# EAGLE design hubboard_v2 (EAGLE 9.0.1)
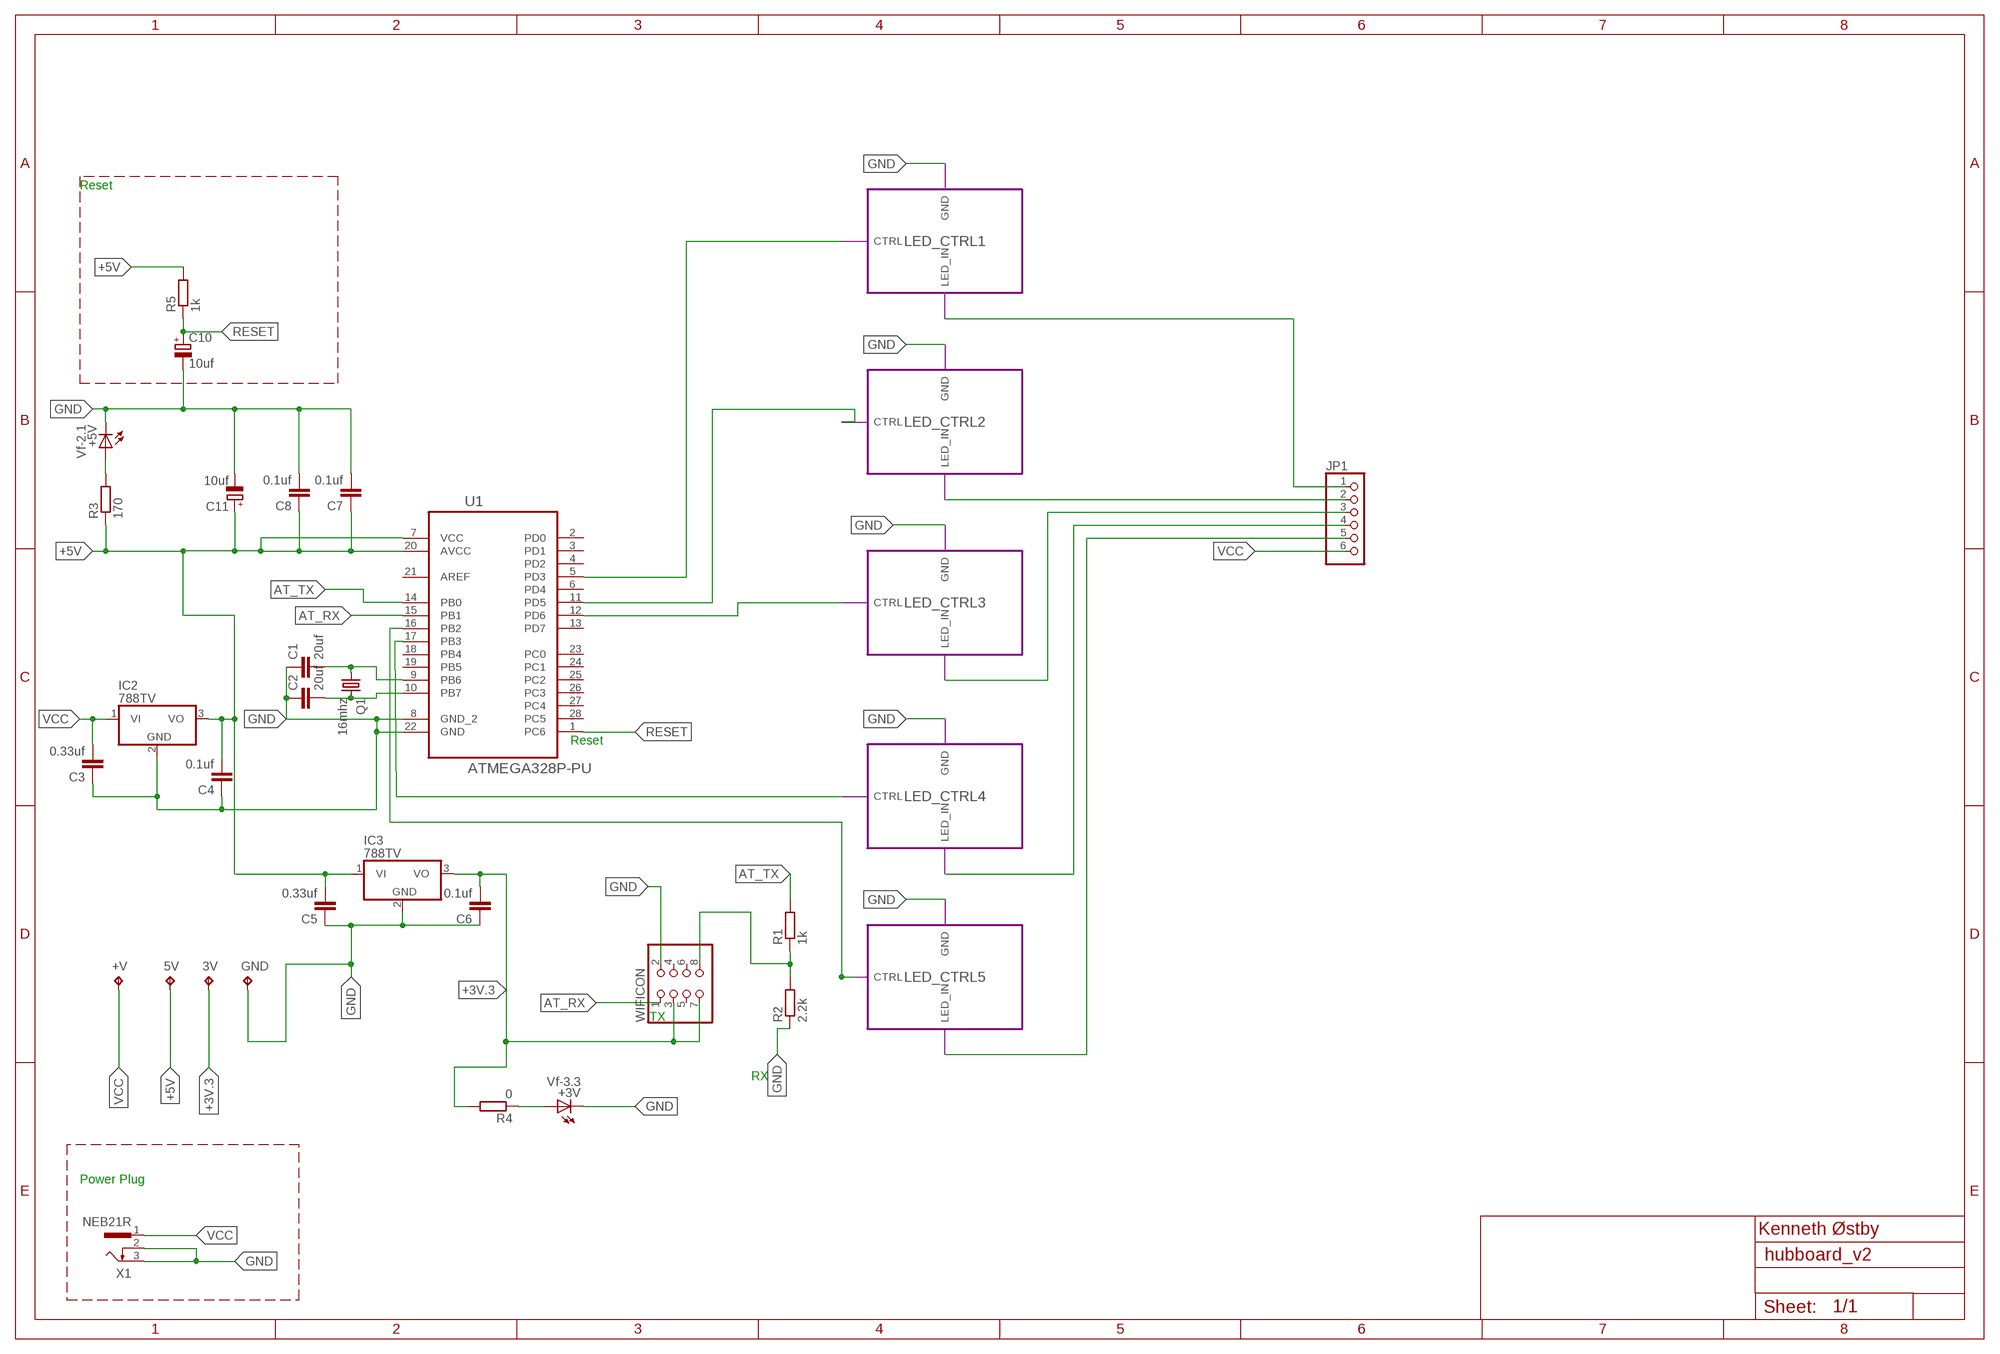
[diagram p0: schematic, sheet 1]

## Parts
3V  TPTP06SQ  [TP06SQ]
5V  TPTP06SQ  [TP06SQ]
+3V  Vf-3.3  LEDCHIP-LED0805  [CHIP-LED0805]
+5V  Vf-2.1  LEDCHIP-LED0805  [CHIP-LED0805]
+V  TPTP06SQ  [TP06SQ]
C1  20uf  C-EU025-040X050  [C025-040X050]
C2  20uf  C-EU025-040X050  [C025-040X050]
C3  0.33uf  C-EUC0805  [C0805]
C4  0.1uf  C-EUC0805  [C0805]
C5  0.33uf  C-EUC2012  [C2012]
C6  0.1uf  C-EUC0805  [C0805]
C7  0.1uf  C-EUC0805  [C0805]
C8  0.1uf  C-EUC0805  [C0805]
C10  10uf  CPOL-EUE2-4  [E2-4]
C11  10uf  CPOL-EUE2-4  [E2-4]
GND  TPTP06SQ  [TP06SQ]
IC2  788TV  [TO220V]
IC3  788TV  [TO220V]
JP1  PINHD-1X6  [1X06]
Q1  16mhz  CRYSTALHC49S  [HC49/S]
R1  1k  R-EU_0207/10  [0207/10]
R2  2.2k  R-EU_0207/10  [0207/10]
R3  170  R-EU_R0805  [R0805]
R4  0  R-EU_R0805  [R0805]
R5  1k  R-EU_R2012  [R2012]
U1  ATMEGA328P-PU  [DIP254P762X457-28]
WIFICON  PINHD-2X4  [2X04]
X1  NEB21R  [NEB21R]

## Module instances
LED_CTRL1 = LED_CTRL
LED_CTRL2 = LED_CTRL
LED_CTRL3 = LED_CTRL
LED_CTRL4 = LED_CTRL
LED_CTRL5 = LED_CTRL

## Nets
+3V.3: 3V.TP C6.2 IC3.3(VO) R4.2 WIFICON.3 WIFICON.7
+5V [+5v]: 5V.TP C4.2 C5.2 C7.1 C8.1 C11.+ IC2.3(VO) IC3.1(VI) R3.1 R5.2 U1.7(VCC) U1.20(AVCC)
AT_RX: U1.15(PB1) WIFICON.1
AT_TX: R1.2 U1.14(PB0)
GND: +3V.C +5V.C C1.1 C2.1 C3.1 C4.1 C5.1 C6.1 C7.2 C8.2 C10.- C11.- GND.TP IC2.2(GND) IC3.2(GND) R2.1 U1.8(GND_2) U1.22(GND) WIFICON.2 X1.2 X1.3 ; port LED_CTRL1.GND LED_CTRL2.GND LED_CTRL3.GND LED_CTRL4.GND LED_CTRL5.GND
N$1: JP1.1 ; port LED_CTRL1.LED_IN
N$2: JP1.2 ; port LED_CTRL2.LED_IN
N$3: JP1.3 ; port LED_CTRL3.LED_IN
N$4: JP1.4 ; port LED_CTRL4.LED_IN
N$5: JP1.5 ; port LED_CTRL5.LED_IN
N$6: U1.17(PB3) ; port LED_CTRL4.CTRL
N$7: U1.5(PD3) ; port LED_CTRL1.CTRL
N$8: U1.12(PD6) ; port LED_CTRL3.CTRL
N$9: C2.2 Q1.2 U1.10(PB7)
N$10: R1.1 R2.2 WIFICON.8
N$11: U1.16(PB2) ; port LED_CTRL5.CTRL
N$12: U1.11(PD5) ; port LED_CTRL2.CTRL
N$13: +5V.A R3.2
N$14: +3V.A R4.1
N$15: C1.2 Q1.1 U1.9(PB6)
RESET [+5v]: C10.+ R5.1 U1.1(PC6)
VCC [vcc]: +V.TP C3.2 IC2.1(VI) JP1.6 X1.1
Unconnected: U1.2(PD0) U1.3(PD1) U1.4(PD2) U1.6(PD4) U1.13(PD7) U1.18(PB4) U1.19(PB5) U1.21(AREF) U1.23(PC0) U1.24(PC1) U1.25(PC2) U1.26(PC3) U1.27(PC4) U1.28(PC5) WIFICON.4 WIFICON.5 WIFICON.6

## Notes on the sheet
- Reset
- Reset
- TX
- RX
- Power Plug
- Kenneth Østby

## Library data of the parts
3V 5V +V GND = testpad:TP: Test pad; OC_FARNELL: unknown
+3V +5V = led:LED: LED OSRAM: - CHIPLED LG R971, LG N971, LY N971, LG Q971, LY Q971, LO R971, LY R971 LH N974, LH R974 LS Q976, LO Q976, LY Q976 LO Q996 - Hyper CHIPLED LW Q18S LB Q993, LB Q99A, LB R99A - SideLED LS A670, LO A670, LY A670, LG A670, LP A670 LB A673, LV A673, LT A673, LW A673 LH A674 LY A675 LS A676, LA A676, LO A676, LY A676, LW A676 LS A679, LY A679, LG A679 - Hyper Micro SIDELED® LS Y876, LA Y876, LO Y876, LY Y876 LT Y87S - SmartLED LW L88C, LW L88S LB L89C, LB L89S, LG L890 LS L89K, LO L89K, LY L89K LS L896, LA L896, LO L896, LY L896 - TOPLED LS T670, LO T670, LY T670, LG T670, LP T670 LSG T670, LSP T670, LSY T670, LOP T670, LYG T670 LG T671, LOG T671, LSG T671 LB T673, LV T673, LT T673, LW T673 LH T674 LS T676, LA T676, LO T676, LY T676, LB T676, LH T676, LSB T676, LW T676 LB T67C, LV T67C, LT T67C, LS T67K, LO T67K, LY T67K, LW E67C LS E67B, LA E67B, LO E67B, LY E67B, LB E67C, LV E67C, LT E67C LW T67C LS T679, LY T679, LG T679 LS T770, LO T770, LY T770, LG T770, LP T770 LB T773, LV T773, LT T773, LW T773 LH T774 LS E675, LA E675, LY E675, LS T675 LS T776, LA T776, LO T776, LY T776, LB T776 LHGB T686 LT T68C, LB T68C - Hyper Mini TOPLED® LB M676 - Mini TOPLED Santana® LG M470 LS M47K, LO M47K, LY M47K Source: http://www.osram.convergy.de LUXEON: - LUMILED® LXK2-PW12-R00, LXK2-PW12-S00, LXK2-PW14-U00, LXK2-PW14-V00 LXK2-PM12-R00, LXK2-PM12-S00, LXK2-PM14-U00 LXK2-PE12-Q00, LXK2-PE12-R00, LXK2-PE12-S00, LXK2-PE14-T00, LXK2-PE14-U00 LXK2-PB12-K00, LXK2-PB12-L00, LXK2-PB12-M00, LXK2-PB14-N00, LXK2-PB14-P00, LXK2-PB14-Q00 LXK2-PR12-L00, LXK2-PR12-M00, LXK2-PR14-Q00, LXK2-PR14-R00 LXK2-PD12-Q00, LXK2-PD12-R00, LXK2-PD12-S00 LXK2-PH12-R00, LXK2-PH12-S00 LXK2-PL12-P00, LXK2-PL12-Q00, LXK2-PL12-R00 Source: www.luxeon.com KINGBRIGHT: KA-3528ASYC Source: www.kingbright.com; OC_FARNELL: unknown
C1-C8 = rcl:C-EU: CAPACITOR, European symbol; OC_FARNELL: unknown; SPICEPREFIX: C
C10 C11 = rcl:CPOL-EU: POLARIZED CAPACITOR, European symbol; SPICEPREFIX: C
IC2 IC3 = linear:78*: Positive VOLTAGE REGULATOR Source: http://cache.national.com/ds/LM/LM78L05.pdf http://www.fairchildsemi.com/ds/LM/LM7805.pdf; OC_FARNELL: unknown
JP1 = pinhead:PINHD-1X6: PIN HEADER; OC_FARNELL: unknown
Q1 = crystal:CRYSTAL: CRYSTAL; MF: MULTICOMP; MPN: HC49SM-3.6864-30-50-60-16-ATF; OC_FARNELL: 1667008; OC_NEWARK: unknown
R1 R5 = rcl:R-EU_: RESISTOR, European symbol; MF: MULTICOMP; MPN: MCF 0.25W 1K; OC_FARNELL: 9339051; SPICEPREFIX: R
R2 = rcl:R-EU_: RESISTOR, European symbol; MF: MULTICOMP; MPN: MF12 2K2; OC_FARNELL: 9342834; SPICEPREFIX: R
R3 R4 = rcl:R-EU_: RESISTOR, European symbol; OC_FARNELL: unknown; SPICEPREFIX: R
U1 = Atmel_By_element14_Batch_1-00:ATMEGA328P-PU: 8-bit Microcontroller with In-System Programmable Flash; MF: MICROCHIP; MPN: ATMEGA328P-PU; OC_FARNELL: 1715487; OC_NEWARK: 15R0268; PACKAGE: PDIP-28; SUPPLIER: Atmel
WIFICON = pinhead:PINHD-2X4: PIN HEADER; OC_FARNELL: unknown
X1 = con-lumberg:NEB21R: Netzgeräte-Einbaukupplung abgewinkelte Ausführung mit Öffner Source: http://www.lumberg.com/Produkte/PDFs/NEB21R.pdf; MF: LUMBERG; MPN: NEB 21 R; OC_FARNELL: 1217037; OC_NEWARK: 97K6458

## Module LED_CTRL
Ports: CTRL(io) GND(io) LED_IN(io)
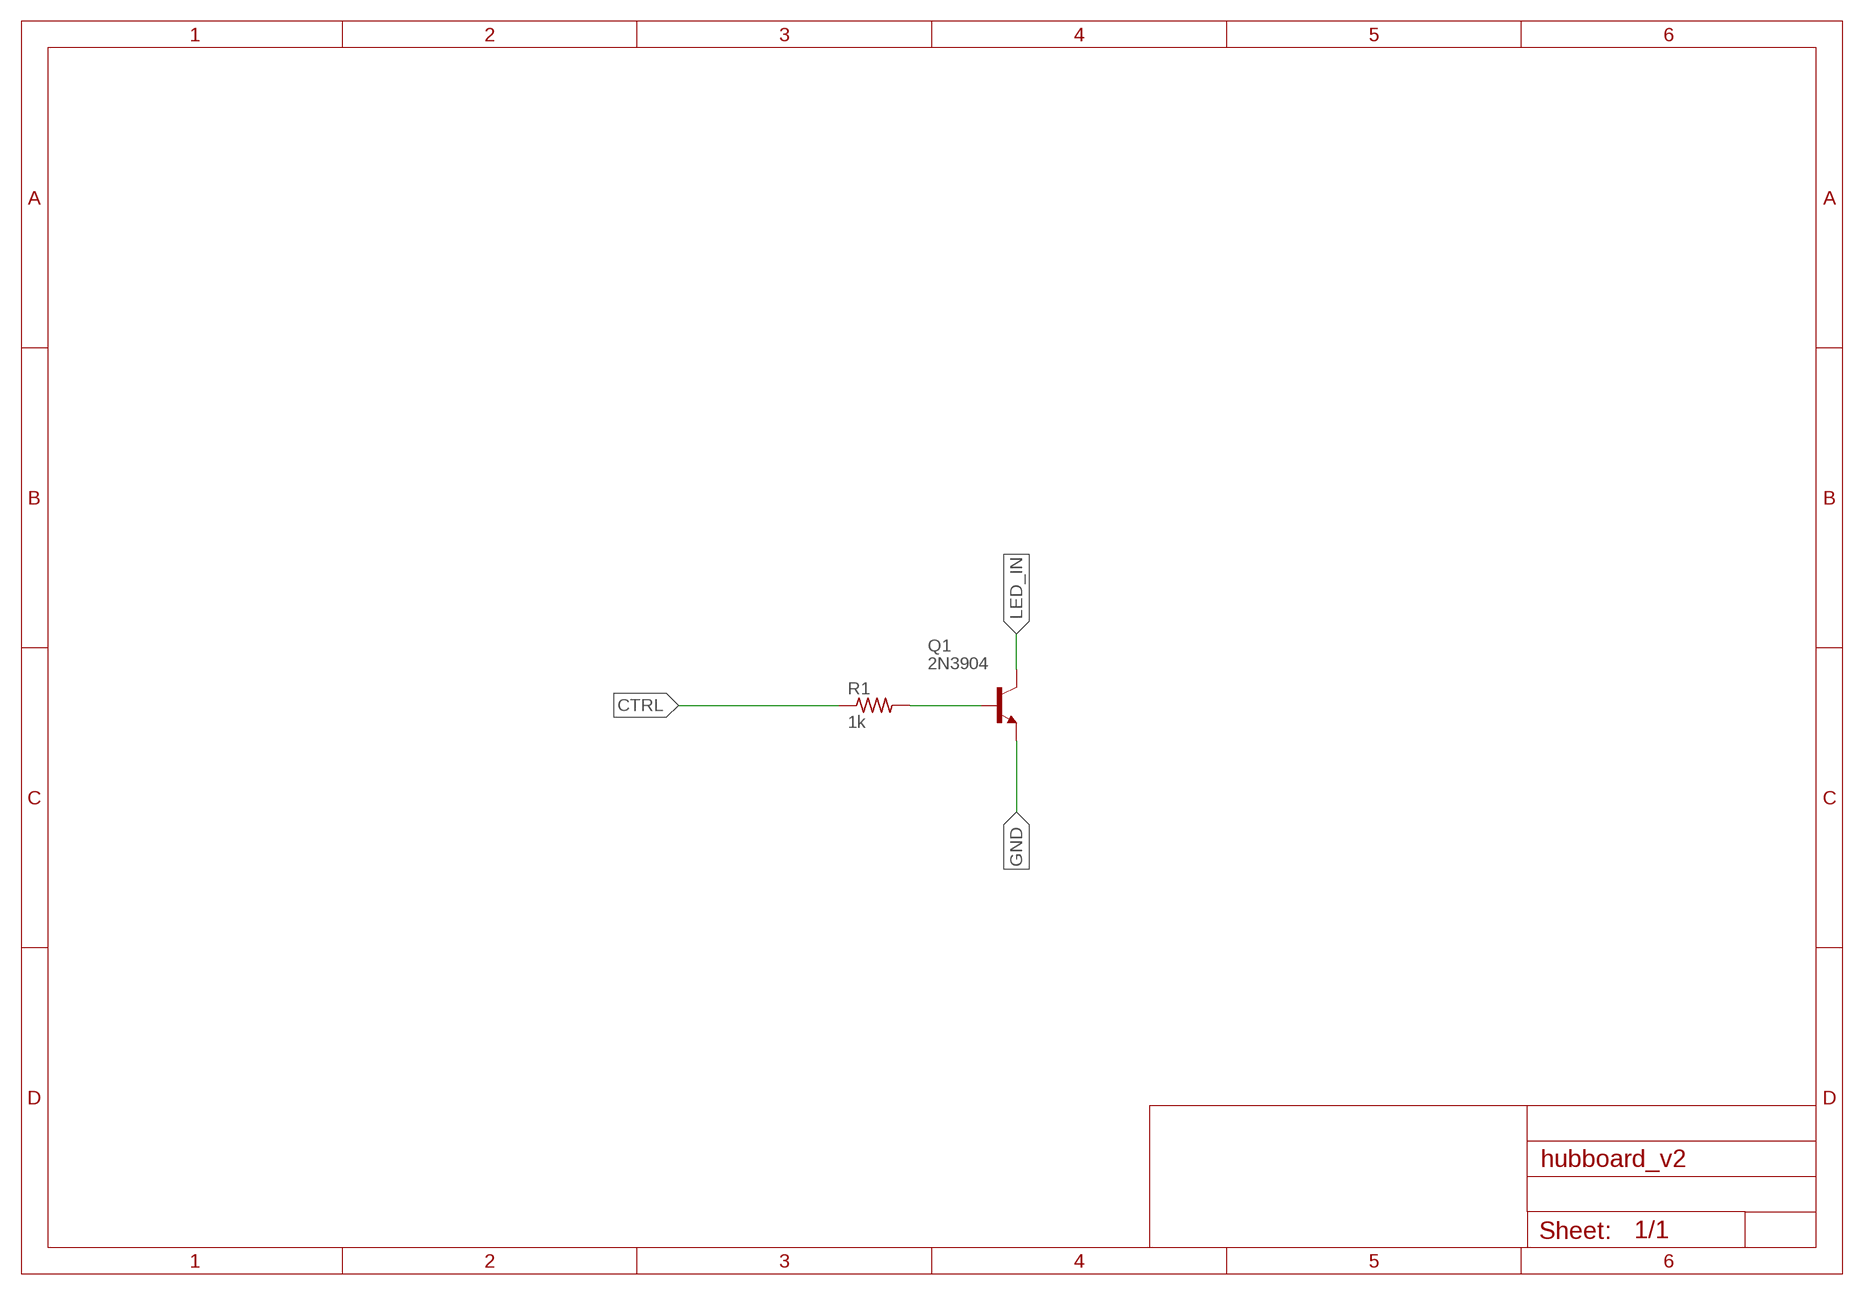
[diagram p1: schematic, module LED_CTRL, sheet 1]

### Parts
Q1  2N3904  [TO92]
R1  1k  R-US_0204/7  [0204/7]

### Nets
CTRL: R1.1
GND: Q1.3(E)
LED_IN: Q1.1(C)
N$1: Q1.2(B) R1.2

### Library data of the parts
Q1 = transistor-npn:2N3904: NPN Transistor; MF: MULTICOMP; MPN: 2N3904; OC_FARNELL: 1574370
R1 = resistor:R-US_: RESISTOR, American symbol; MF: MULTICOMP; MPN: MCF 0.25W 1K; OC_FARNELL: 9339051

## Net classes
1 +5v: width 0.508 mm, clearance 0.127 mm
2 vcc: width 0.508 mm, clearance 0.127 mm

## Board
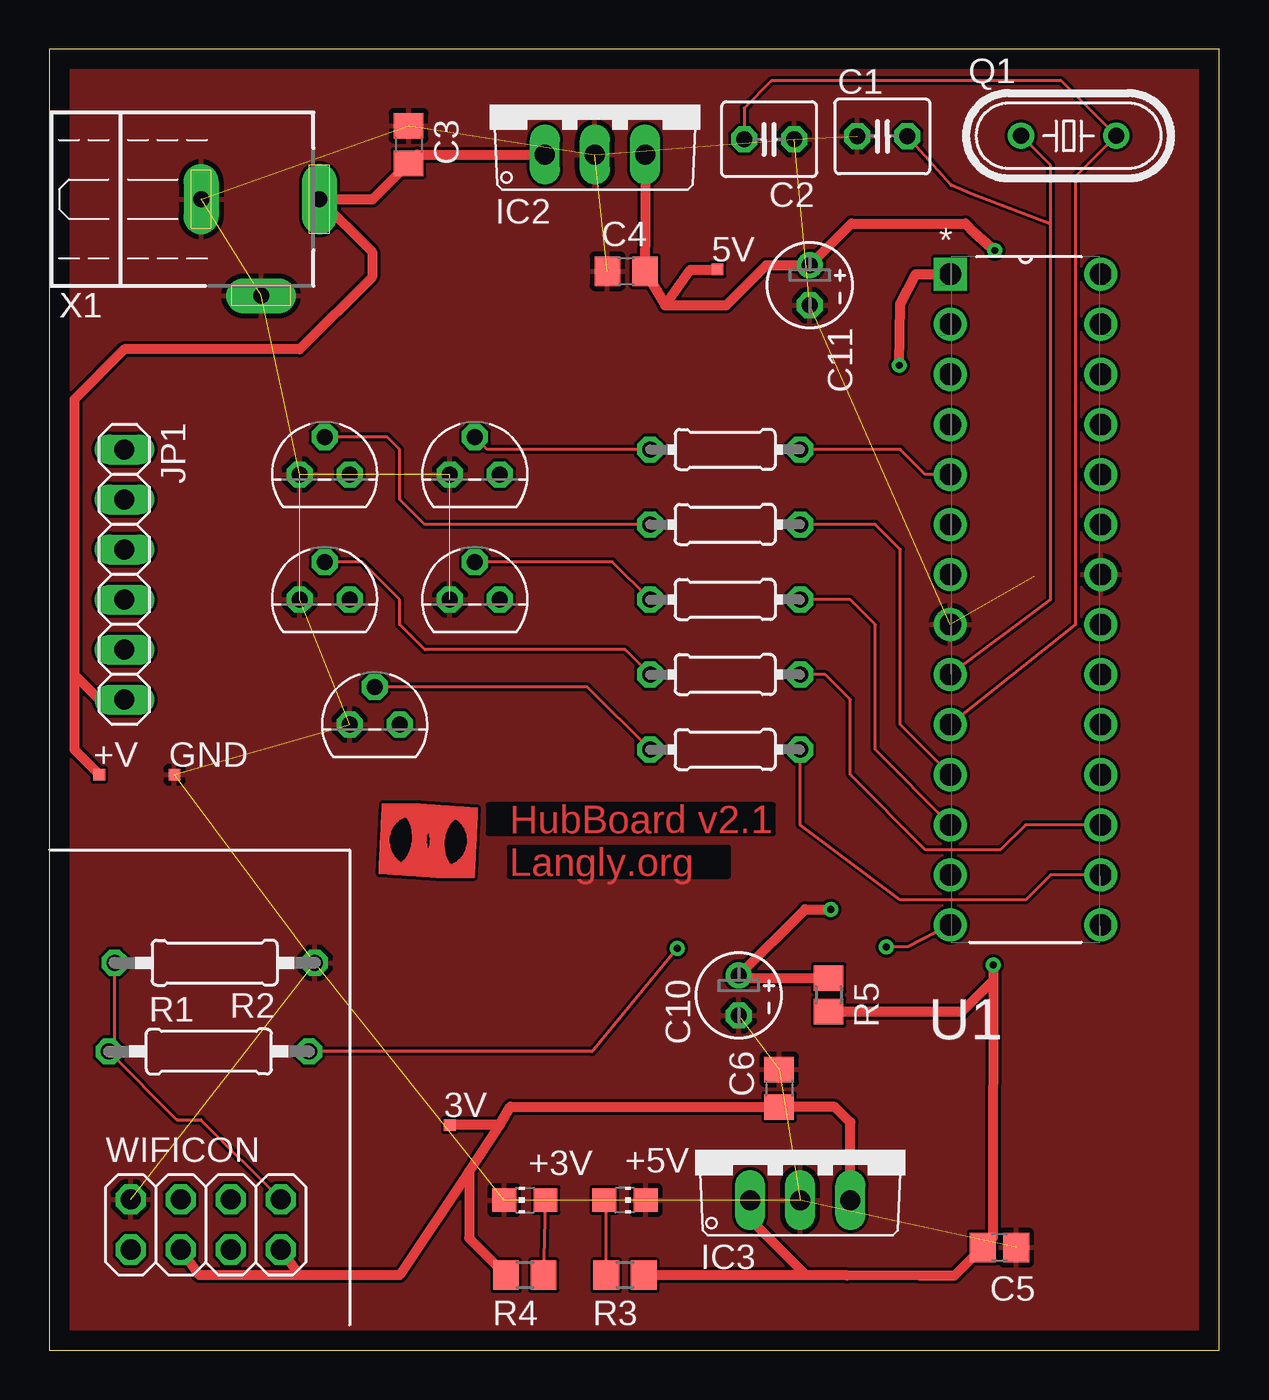
[diagram p2: board, top side]
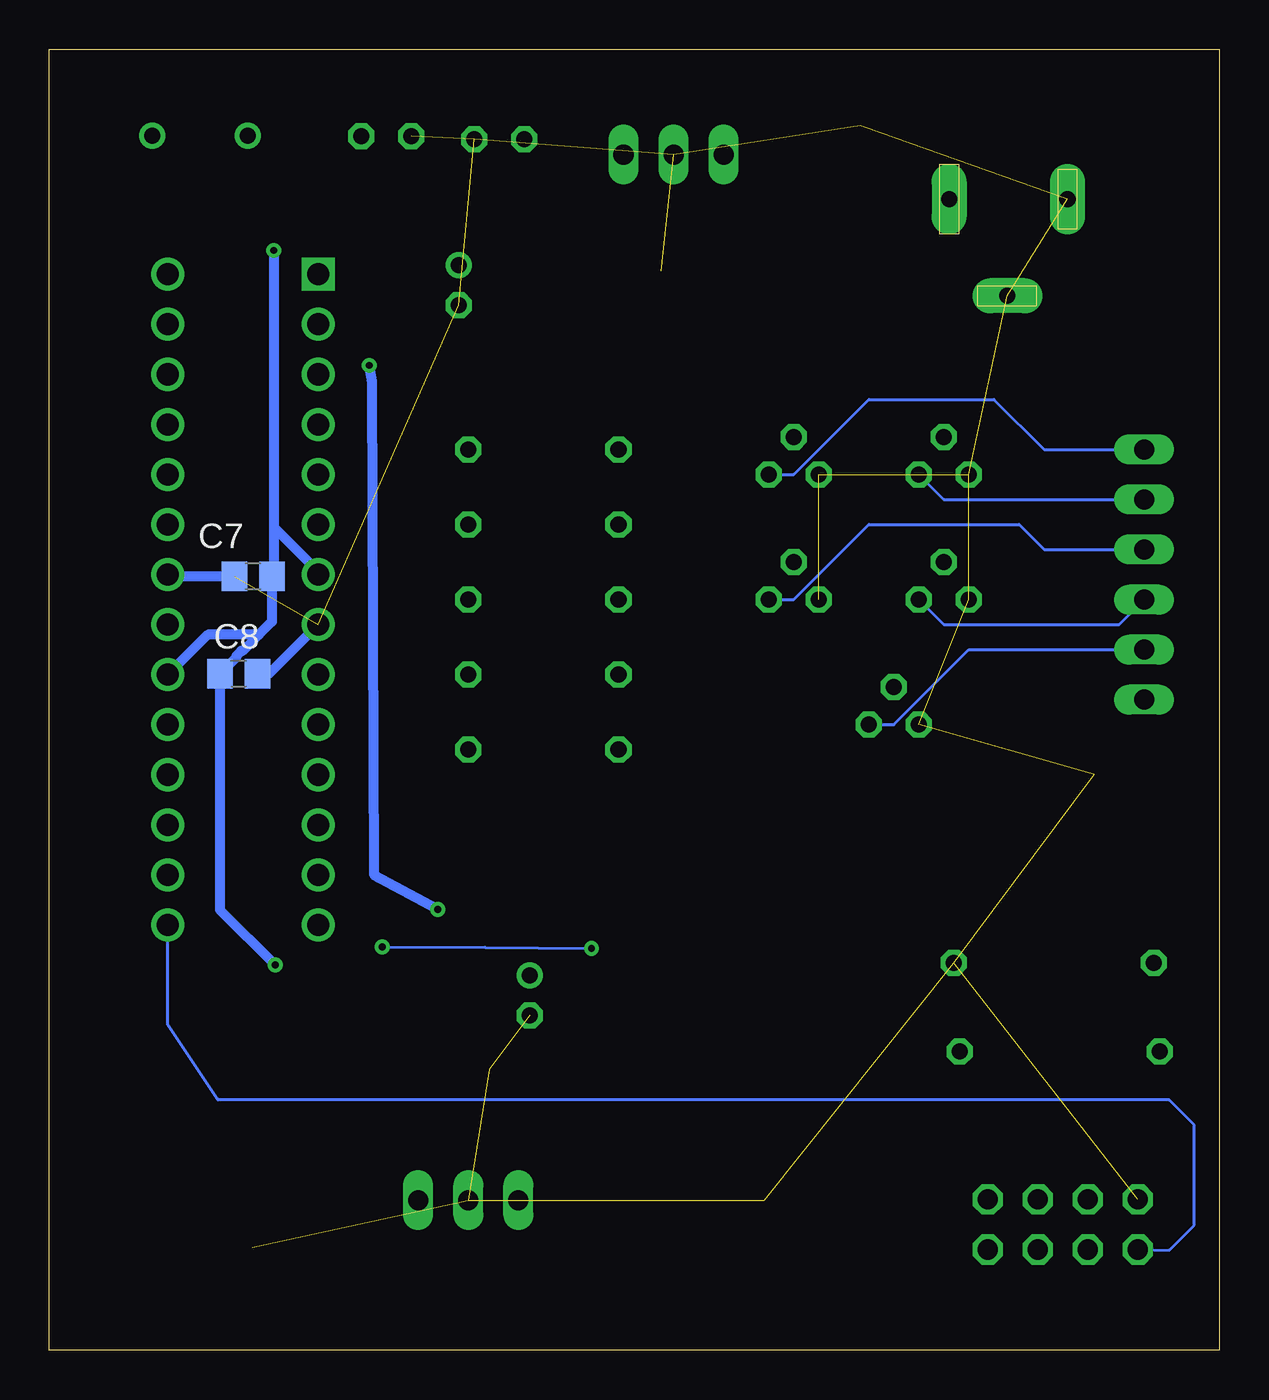
[diagram p3: board, bottom side, seen from below]

Size 59.36 x 66.03 mm. Coordinates in mm from the lower left corner, seen from the top.
Outline: 0,0 59.36,0 59.36,66.03 0,66.03 0,0
Copper layers (1*16): Top 0.035mm / dielectric 1.5mm / Bottom 0.035mm
Design rules "default": minimum track width 6mil, minimum drill 0.35mm, track to track 6mil, track to pad 6mil, pad to pad 6mil, via to via 6mil, smd to smd 6mil, copper to edge 40mil, drill to drill 6mil, minimum pad ring 10mil, minimum via ring 8mil, stop-mask expansion 4mil, vias tented up to drill 0mil, thermal gap 10mil

### Footprints (pad centres in the part's own frame; a part is rotated, then mirrored left to right if it is on the bottom)
TP06SQ = smd 0.6 x 0.6: TP 0,0
CHIP-LED0805 = smd 1.2 x 1.2: A 0,-1.05; C 0,1.05
C025-040X050 = drill 0.813 octagon: 1 -1.27,0; 2 1.27,0
C0805 = smd 1.3 x 1.5: 1 -0.95,0; 2 0.95,0
C2012 = smd 1.3 x 1.5: 1 -0.85,0; 2 0.85,0
E2-4 = drill 0.813 pad 1.27: + -1.016,0 | drill 0.813 pad 1.27 octagon: - 1.016,0
TO220V = drill 1.016 long: 1 -2.54,-2.54; 2 0,-2.54; 3 2.54,-2.54
1X06 = drill 1.016 long: 1 -6.35,0; 2 -3.81,0; 3 -1.27,0; 4 1.27,0; 5 3.81,0; 6 6.35,0
TO92 = drill 0.813 octagon: 1 1.27,0; 2 0,1.905; 3 -1.27,0
0204/7 = drill 0.813 octagon: 1 -3.81,0; 2 3.81,0
HC49/S = drill 0.813: 1 -2.413,0; 2 2.413,0
0207/10 = drill 0.813 octagon: 1 -5.08,0; 2 5.08,0
R0805 = smd 1.3 x 1.5: 1 -0.95,0; 2 0.95,0
R2012 = smd 1.3 x 1.5: 1 -0.85,0; 2 0.85,0
DIP254P762X457-28 = drill 1.118 square: 1 -7.62,33.02 | drill 1.118: 2 -7.62,30.48; 3 -7.62,27.94; 4 -7.62,25.4; 5 -7.62,22.86; 6 -7.62,20.32; 7 -7.62,17.78; 8 -7.62,15.24; 9 -7.62,12.7; 10 -7.62,10.16; 11 -7.62,7.62; 12 -7.62,5.08; 13 -7.62,2.54; 14 -7.62,0; 15 0,0; 16 0,2.54; 17 0,5.08; 18 0,7.62; 19 0,10.16; 20 0,12.7; 21 0,15.24; 22 0,17.78; 23 0,20.32; 24 0,22.86; 25 0,25.4; 26 0,27.94; 27 0,30.48; 28 0,33.02
2X04 = drill 1.016 octagon: 1 -3.81,-1.27; 2 -3.81,1.27; 3 -1.27,-1.27; 4 -1.27,1.27; 5 1.27,-1.27; 6 1.27,1.27; 7 3.81,-1.27; 8 3.81,1.27
NEB21R = drill 0.813 pad 1.778 long: 1 0,7.35; 2 4.9,4.4; 3 0,1.35

### Placement (x,y rotation side)
3V  20.32,11.43 0 top
5V  33.9,54.85 0 top
+3V  24.13,7.62 90 top
+5V  29.21,7.62 270 top
+V  2.54,29.21 0 top
C1  42.27,61.61 0 top
C2  36.53,61.46 180 top
C3  18.23,61.19 270 top
C4  29.27,54.76 0 top
C5  48.21,5.21 180 top
C6  37.03,13.3 270 top
C7  49.01,39.28 180 bottom
C8  49.75,34.34 0 bottom
C10  34.98,18 270 top
C11  38.59,54.05 270 top
GND  6.35,29.21 0 top
IC2  27.69,63.23 0 top
IC3  38.1,10.16 0 top
JP1  3.81,39.37 270 top
LED_CTRL1:Q1  2N3904  [TO92]  21.59,44.45 0 top
LED_CTRL1:R1  1k  [0204/7]  34.29,45.72 180 top
LED_CTRL2:Q1  2N3904  [TO92]  13.97,44.45 0 top
LED_CTRL2:R1  1k  [0204/7]  34.29,41.91 180 top
LED_CTRL3:Q1  2N3904  [TO92]  21.59,38.1 0 top
LED_CTRL3:R1  1k  [0204/7]  34.29,38.1 180 top
LED_CTRL4:Q1  2N3904  [TO92]  13.97,38.1 0 top
LED_CTRL4:R1  1k  [0204/7]  34.29,34.29 180 top
LED_CTRL5:Q1  2N3904  [TO92]  16.51,31.75 0 top
LED_CTRL5:R1  1k  [0204/7]  34.29,30.48 180 top
Q1  51.71,61.64 0 top
R1  8.1,15.16 0 top
R2  8.39,19.67 180 top
R3  29.21,3.81 180 top
R4  24.13,3.81 180 top
R5  39.54,18.03 270 top
U1  53.34,21.59 0 top
WIFICON  7.93,6.38 0 top
X1  6.35,58.42 270 top

### Tracks (layer width: path | path; a pad name or v marks a point on that pad's centre or on a via)
+3V.3
  Top 0.508: 22.86,11.43 21.3,9.09 | 21.3,9.09 17.78,3.81 12.7,3.81 | 12.7,3.81 7.62,3.81 WIFICON.3 | 12.7,3.81 WIFICON.7 | 21.3,9.09 21.3,5.69 R4.2 | 22.86,11.43 3V.TP | 22.86,11.43 23.4,12.36 C6.2 | IC3.3 40.64,11.57 39.86,12.35 C6.2 | C6.2
+5V  (via drill 0.35)
  Top 0.508: v47.97,55.82 46.94,56.73 46.49,57.18 40.7,57.18 C11.+ 36.37,55.07 34.34,53.03 31.24,53.03 | v47.89,19.55 47.89,18.77 | 47.89,18.77 47.88,17.72 47.87,9.2 47.87,5.73 C5.2 45.93,3.78 44.16,3.78 40.48,3.8 39.37,3.81 38.41,3.81 | 38.41,3.81 R3.1 | 38.41,3.81 35.56,6.66 IC3.1 | IC2.3 30.23,57.16 C4.2 31.24,53.03 | 31.24,53.03 32.52,54.84 5V.TP | 47.89,18.77 46.31,17.18 R5.2
  Bottom 0.508: v47.89,19.55 50.7,22.36 C8.1 49.86,35.18 49.86,35.26 49.62,35.5 49.55,35.5 48.73,36.31 | v47.97,55.82 47.97,41.77 | 47.97,41.77 47.97,39.38 C7.1 48.06,36.98 48.73,36.31 | 48.73,36.31 51.32,36.31 U1.20 | 47.97,41.77 45.72,39.52 U1.7
AT_RX
  Bottom 0.152: WIFICON.1 2.54,5.08 1.27,6.35 1.27,11.43 2.54,12.7 50.8,12.7 53.34,16.51 U1.15
AT_TX  (via drill 0.35)
  Top 0.152: v31.85,20.39 27.61,15.23 27.53,15.16 R1.2 | U1.14 43.57,20.47 v42.47,20.46
  Bottom 0.152: v42.47,20.46 37.25,20.45 v31.85,20.39
GND  (23 unrouted)
  Bottom 0.508: C8.2 48.21,34.34 U1.8 | C7.2 53.25,39.28 U1.22
  pour Top: 0,66.04 59.69,66.04 59.69,-1.27 0,-1.27
LED_CTRL1:N$1
  Top 0.152: LED_CTRL1:Q1.2 22.23,45.72 LED_CTRL1:R1.2
LED_CTRL2:N$1
  Top 0.152: LED_CTRL2:R1.2 19.05,41.91 17.78,43.18 17.78,45.72 17.14,46.35 LED_CTRL2:Q1.2
LED_CTRL3:N$1
  Top 0.152: LED_CTRL3:R1.2 28.57,40.01 LED_CTRL3:Q1.2
LED_CTRL4:N$1
  Top 0.152: LED_CTRL4:R1.2 29.21,35.56 19.05,35.56 17.78,36.83 17.78,38.1 15.88,40.01 LED_CTRL4:Q1.2
LED_CTRL5:N$1
  Top 0.152: LED_CTRL5:Q1.2 27.3,33.66 LED_CTRL5:R1.2
N$1
  Bottom 0.152: LED_CTRL1:Q1.1 21.59,44.45 17.78,48.26 11.43,48.26 8.89,45.72 JP1.1
N$2
  Bottom 0.152: LED_CTRL2:Q1.1 13.97,43.18 JP1.2
N$3
  Bottom 0.152: LED_CTRL3:Q1.1 21.59,38.1 17.78,41.91 10.16,41.91 8.89,40.64 JP1.3
N$4
  Bottom 0.152: LED_CTRL4:Q1.1 13.97,36.83 5.08,36.83 JP1.4
N$5
  Bottom 0.152: LED_CTRL5:Q1.1 16.51,31.75 12.7,35.56 JP1.5
N$6
  Top 0.152: U1.17 49.53,26.67 48.26,25.4 44.45,25.4 40.64,29.21 40.64,33.02 39.37,34.29 LED_CTRL4:R1.1
N$7
  Top 0.152: U1.5 44.45,44.45 43.18,45.72 LED_CTRL1:R1.1
N$8
  Top 0.152: U1.12 41.91,30.48 41.91,36.83 40.64,38.1 LED_CTRL3:R1.1
N$9
  Top 0.152: U1.10 52.07,36.83 52.07,59.58 Q1.2 51.34,64.42 36.64,64.42 35.26,63.04 C2.2
N$10
  Top 0.152: R2.2 3.31,15.45 R1.1 6.47,11.7 7.69,11.7 WIFICON.8
N$11
  Top 0.152: U1.16 50.8,24.13 49.53,22.86 43.18,22.86 38.1,26.67 LED_CTRL5:R1.1
N$12
  Top 0.152: U1.11 43.18,31.75 43.18,40.64 41.91,41.91 LED_CTRL2:R1.1
N$13
  Top 0.152: R3.2 28.26,7.52 +5V.A
N$14
  Top 0.152: R4.1 25.08,3.71 +3V.A
N$15
  Top 0.152: U1.9 50.8,38.1 50.8,57.15 | 50.8,57.15 46.76,58.7 45.76,59.13 C1.2 | 50.8,57.15 50.8,60.14 Q1.1
RESET  (via drill 0.35)
  Top 0.508: v43.13,49.99 43.17,53.11 43.95,54.61 U1.1 | R5.1 35.12,18.88 C10.+ 38.34,22.38 v39.64,22.38
  Bottom 0.508: v39.64,22.38 42.87,24.1 42.98,49.16 v43.13,49.99
VCC
  Top 0.508: 1.27,34.29 1.27,48.26 3.81,50.8 12.7,50.8 16.38,54.48 16.38,55.74 X1.1 16.4,58.42 C3.2 18.67,60.69 IC2.1 | 1.27,34.29 2.54,33.02 JP1.6 | 1.27,34.29 1.27,30.48 +V.TP
(copper drawn outside any net)
  shapes: Top area x912

### Text on the board
Top: HubBoard v2.1 | Langly.org
200bmp: C:/Users/langly/Pictures/csg.bmp